# EAGLE schematic mouse_v3 (EAGLE 8.6.1)
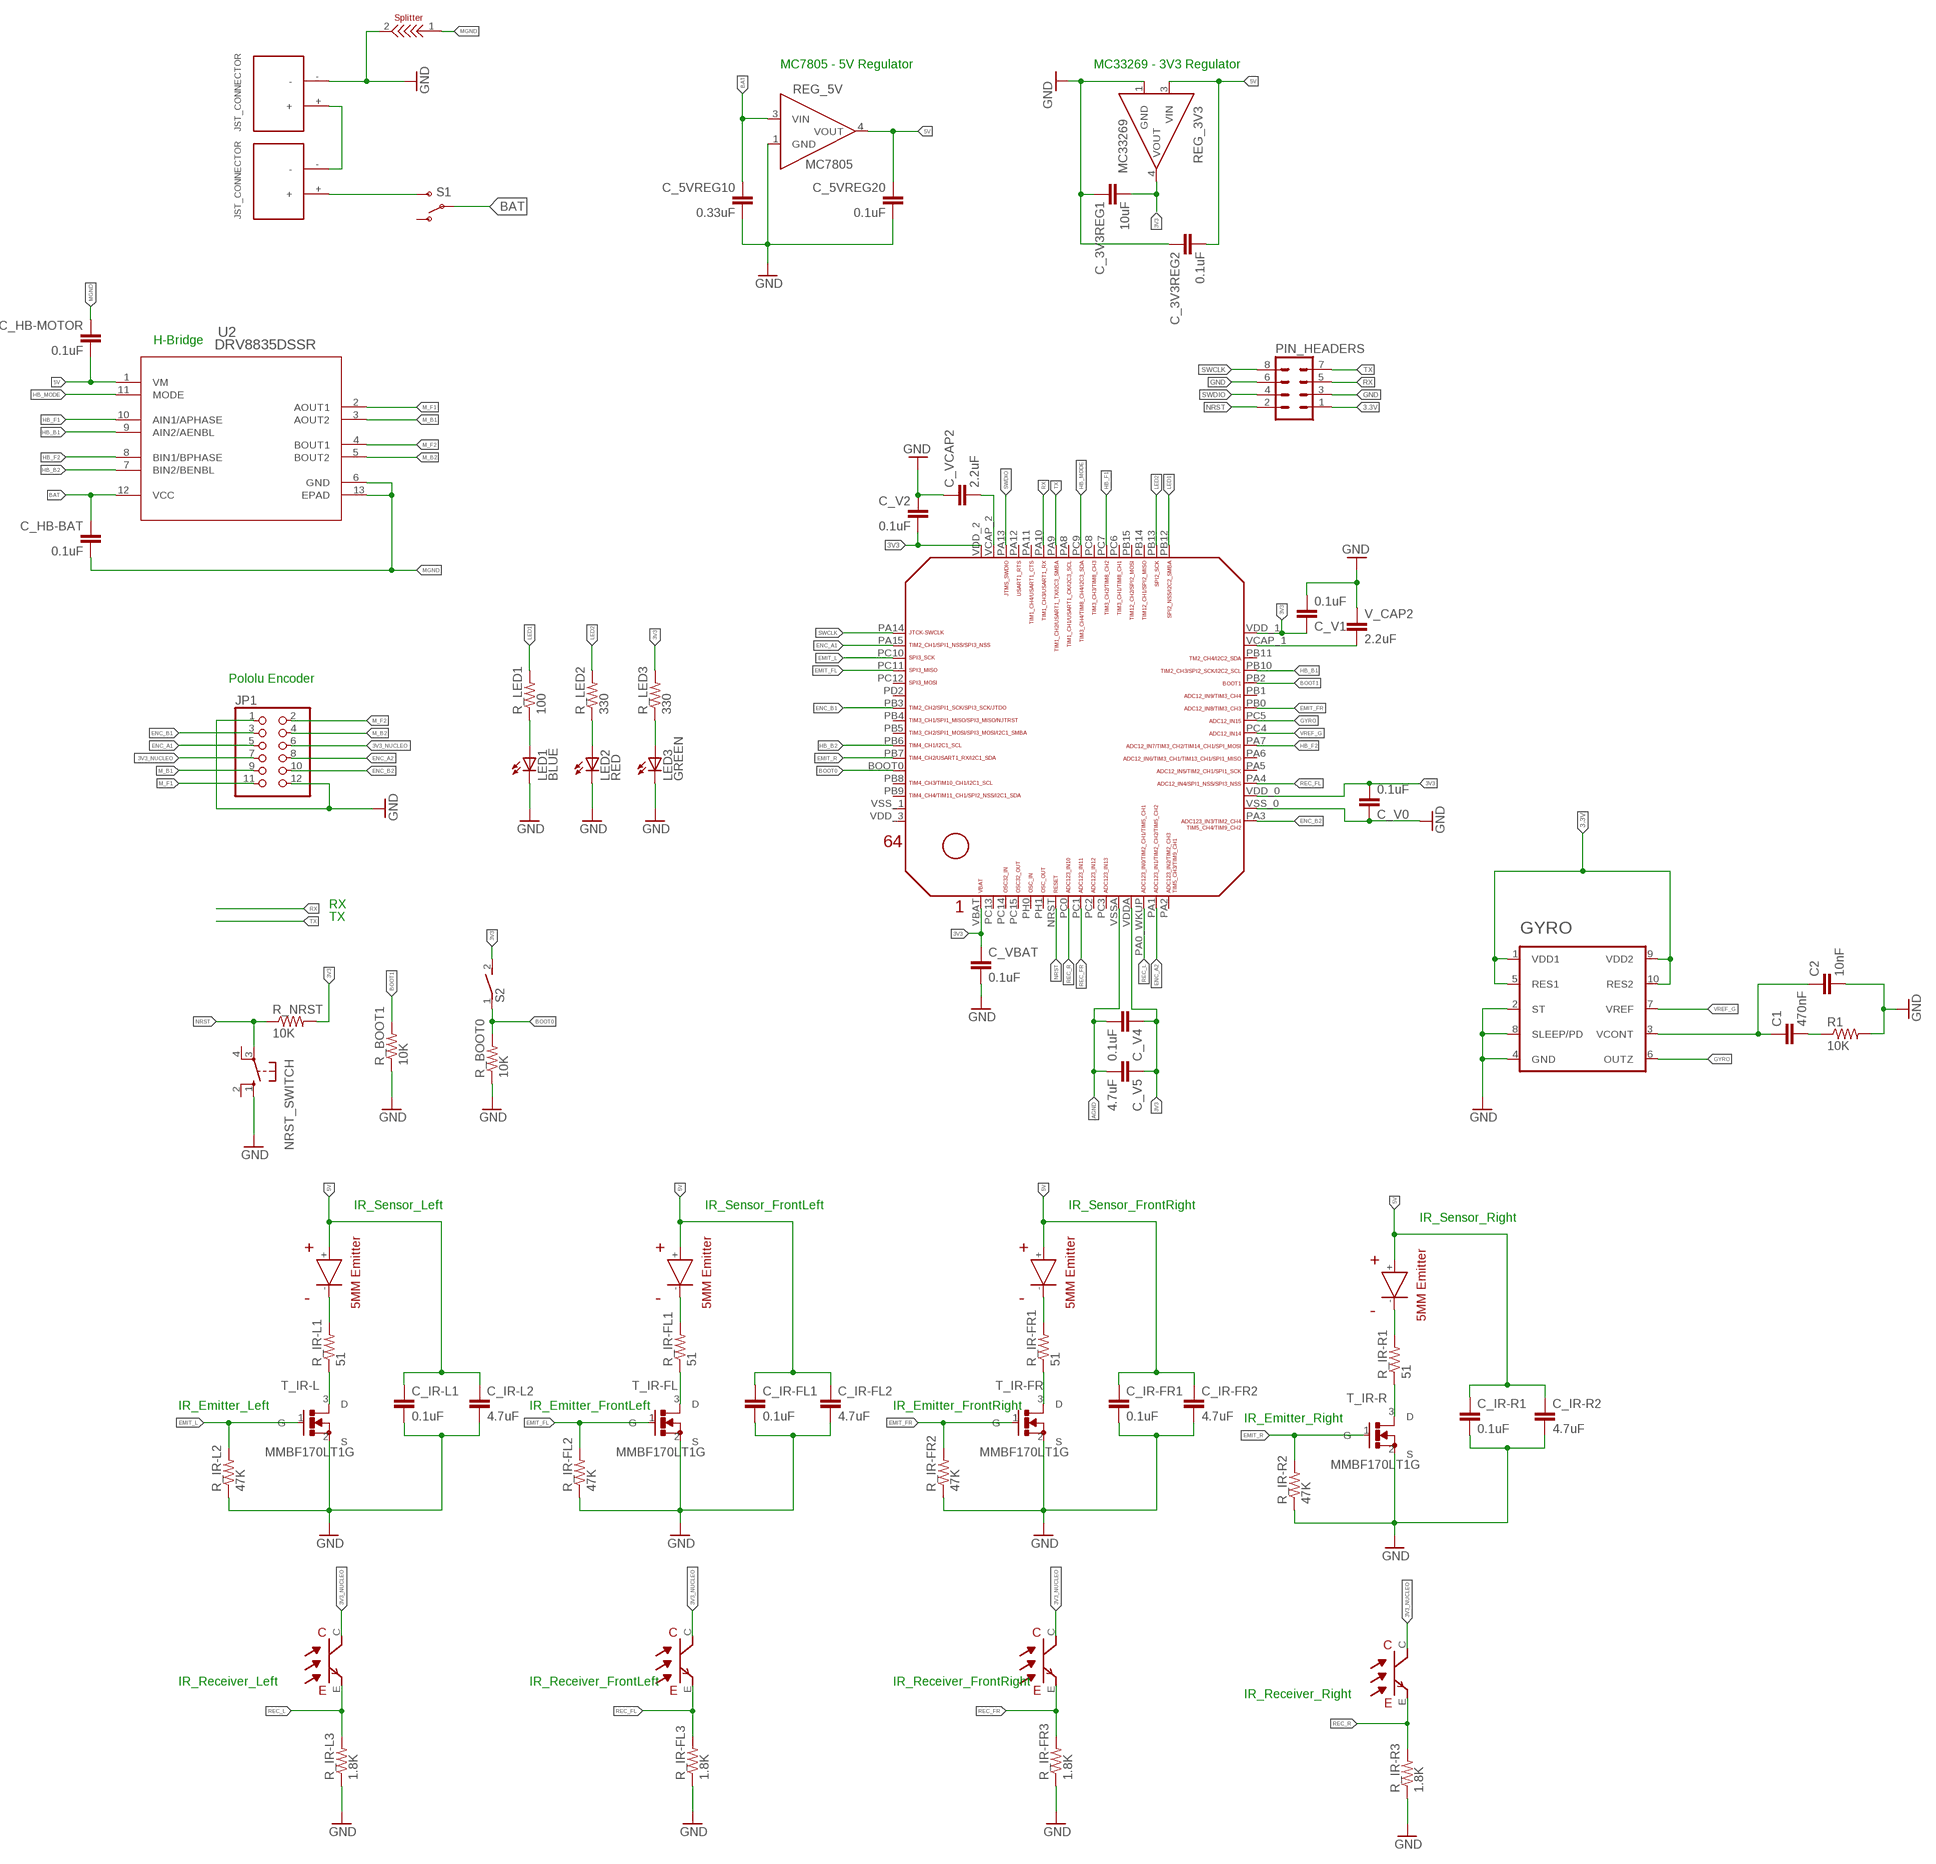
[diagram p0: schematic, sheet 1]

## Parts
C1  470nF  C2,5-3  [C2.5-3]
C2  10nF  C2,5-3  [C2.5-3]
C_3V3REG1  10uF  CAP0603-CAP  [0603-CAP]
C_3V3REG2  0.1uF  CAP0603-CAP  [0603-CAP]
C_5VREG10  0.33uF  CAP0603-CAP  [0603-CAP]
C_5VREG20  0.1uF  CAP0603-CAP  [0603-CAP]
C_HB-BAT  0.1uF  CAP0603-CAP  [0603-CAP]
C_HB-MOTOR  0.1uF  CAP0603-CAP  [0603-CAP]
C_IR-FL1  0.1uF  CAP0603-CAP  [0603-CAP]
C_IR-FL2  4.7uF  CAP0603-CAP  [0603-CAP]
C_IR-FR1  0.1uF  CAP0603-CAP  [0603-CAP]
C_IR-FR2  4.7uF  CAP0603-CAP  [0603-CAP]
C_IR-L1  0.1uF  CAP0603-CAP  [0603-CAP]
C_IR-L2  4.7uF  CAP0603-CAP  [0603-CAP]
C_IR-R1  0.1uF  CAP0603-CAP  [0603-CAP]
C_IR-R2  4.7uF  CAP0603-CAP  [0603-CAP]
C_V0  0.1uF  CAP0603-CAP  [0603-CAP]
C_V1  0.1uF  CAP0603-CAP  [0603-CAP]
C_V2  0.1uF  CAP0603-CAP  [0603-CAP]
C_V4  0.1uF  CAP0603-CAP  [0603-CAP]
C_V5  4.7uF  CAP0603-CAP  [0603-CAP]
C_VBAT  0.1uF  CAP0603-CAP  [0603-CAP]
C_VCAP2  2.2uF  CAP0603-CAP  [0603-CAP]
GYRO  LY3200ALH  [10-TLGA]
IR_FL  EMITTER  [EMITTER]
IR_FR  EMITTER  [EMITTER]
IR_L  EMITTER  [EMITTER]
IR_R  EMITTER  [EMITTER]
JP1  PINHD-2X6  [2X06]
LED1  BLUE  LEDCHIPLED_0603  [CHIPLED_0603]
LED2  RED  LEDCHIPLED_0603  [CHIPLED_0603]
LED3  GREEN  LEDCHIPLED_0603  [CHIPLED_0603]
NRST_SWITCH  10-XX  [B3F-10XX]
PIN_HEADERS  MA04-2  [MA04-2]
R1  10K  R-US_0204/2V  [0204V]
R_BOOT0  10K  R-US_0204/2V  [0204V]
R_BOOT1  10K  R-US_0204/2V  [0204V]
R_IR-FL1  51  1.8KOHM1/10W1%(0603)  [0603-RES]
R_IR-FL2  47K  1.8KOHM1/10W1%(0603)  [0603-RES]
R_IR-FL3  1.8K  1.8KOHM1/10W1%(0603)  [0603-RES]
R_IR-FR1  51  1.8KOHM1/10W1%(0603)  [0603-RES]
R_IR-FR2  47K  1.8KOHM1/10W1%(0603)  [0603-RES]
R_IR-FR3  1.8K  1.8KOHM1/10W1%(0603)  [0603-RES]
R_IR-L1  51  1.8KOHM1/10W1%(0603)  [0603-RES]
R_IR-L2  47K  1.8KOHM1/10W1%(0603)  [0603-RES]
R_IR-L3  1.8K  1.8KOHM1/10W1%(0603)  [0603-RES]
R_IR-R1  51  1.8KOHM1/10W1%(0603)  [0603-RES]
R_IR-R2  47K  1.8KOHM1/10W1%(0603)  [0603-RES]
R_IR-R3  1.8K  1.8KOHM1/10W1%(0603)  [0603-RES]
R_LED1  100  1.8KOHM1/10W1%(0603)  [0603-RES]
R_LED2  330  1.8KOHM1/10W1%(0603)  [0603-RES]
R_LED3  330  1.8KOHM1/10W1%(0603)  [0603-RES]
R_NRST  10K  R-US_0204/2V  [0204V]
REG_3V3  MC33269  [TO-252-3]
REG_5V  MC7805  [TO-252-3]
S1  SWITCH-SPSTKIT  [SWITCH-SPDT_KIT]
S2  DS01E  [DS-01]
T_IR-FL  MMBF170LT1G  [SOT-23]
T_IR-FR  MMBF170LT1G  [SOT-23]
T_IR-L  MMBF170LT1G  [SOT-23]
T_IR-R  MMBF170LT1G  [SOT-23]
U2  DRV8835DSSR  [DSS12_P9X2]
U$1  STM32F405/415_LQFP64  [STM32F405/415_LQFP64]
U$2  JST_CONNECTOR_FEMALE  [JST_CONNECTOR_FEMALE]
U$3  JST_CONNECTOR_FEMALE  [JST_CONNECTOR_FEMALE]
U$4  RECEIVER  [RECEIVER]
U$5  RECEIVER  [RECEIVER]
U$6  RECEIVER  [RECEIVER]
U$7  RECEIVER  [RECEIVER]
U$8  SPLITTER  [SPLITTER]
V_CAP2  2.2uF  CAP0603-CAP  [0603-CAP]

## Nets
3.3V: GYRO.1(VDD1) GYRO.5(RES1) GYRO.9(VDD2) GYRO.10(RES2) PIN_HEADERS.1
3V3: C_3V3REG1.2 C_V0.2 C_V1.1 C_V2.2 C_V4.1 C_V5.1 C_VBAT.1 R_LED3.2 R_NRST.2 REG_3V3.4(VOUT) S2.2 U$1.VBAT U$1.VDD_0 U$1.VDD_1 U$1.VDD_2 U$1.VDDA
3V3_NUCLEO: JP1.6 JP1.7 U$4.C U$5.C U$6.C U$7.C
5V: C_3V3REG2.2 C_5VREG20.1 C_HB-MOTOR.2 C_IR-FL1.1 C_IR-FL2.1 C_IR-FR1.1 C_IR-FR2.1 C_IR-L1.1 C_IR-L2.1 C_IR-R1.1 C_IR-R2.1 IR_FL.+ IR_FR.+ IR_L.+ IR_R.+ REG_3V3.3(VIN) REG_5V.4(VOUT) U2.1(VM)
AGND: C_V4.2 C_V5.2 U$1.VSSA
BAT: C_5VREG10.1 C_HB-BAT.1 REG_5V.3(VIN) S1.2(P) U2.12(VCC)
BOOT0: R_BOOT0.2 S2.1 U$1.BOOT0
BOOT1: R_BOOT1.2 U$1.PB2
EMIT_FL: R_IR-FL2.2 T_IR-FL.1(G) U$1.PC11
EMIT_FR: R_IR-FR2.2 T_IR-FR.1(G) U$1.PB0
EMIT_L: R_IR-L2.2 T_IR-L.1(G) U$1.PC10
EMIT_R: R_IR-R2.2 T_IR-R.1(G) U$1.PB7
ENC_A1: JP1.5 U$1.PA15
ENC_A2: JP1.8 U$1.PA1
ENC_B1: JP1.3 U$1.PB3
ENC_B2: JP1.10 U$1.PA3
GND: C2.2 C_3V3REG1.1 C_3V3REG2.1 C_5VREG10.2 C_5VREG20.2 C_IR-FL1.2 C_IR-FL2.2 C_IR-FR1.2 C_IR-FR2.2 C_IR-L1.2 C_IR-L2.2 C_IR-R1.2 C_IR-R2.2 C_V0.1 C_V1.2 C_V2.1 C_VBAT.2 C_VCAP2.1 GYRO.2(ST) GYRO.4(GND) GYRO.8(SLEEP/PD) JP1.1 JP1.12 LED1.C LED2.C LED3.C NRST_SWITCH.1(S) PIN_HEADERS.3 PIN_HEADERS.6 R1.2 R_BOOT0.1 R_IR-FL2.1 R_IR-FL3.1 R_IR-FR2.1 R_IR-FR3.1 R_IR-L2.1 R_IR-L3.1 R_IR-R2.1 R_IR-R3.1 REG_3V3.1(GND) REG_5V.1(GND) T_IR-FL.2(S) T_IR-FR.2(S) T_IR-L.2(S) T_IR-R.2(S) U$1.VSS_0 U$2.- U$8.2 V_CAP2.1
GYRO: GYRO.6(OUTZ) U$1.PC5
HB_B1: U2.9(AIN2/AENBL) U$1.PB10
HB_B2: U2.7(BIN2/BENBL) U$1.PB6
HB_F1: U2.10(AIN1/APHASE) U$1.PC7
HB_F2: U2.8(BIN1/BPHASE) U$1.PA7
HB_MODE: U2.11(MODE) U$1.PC9
LED1: R_LED1.2 U$1.PB12
LED2: R_LED2.2 U$1.PB13
M_B1: JP1.9 U2.3(AOUT2)
M_B2: JP1.4 U2.5(BOUT2)
M_F1: JP1.11 U2.2(AOUT1)
M_F2: JP1.2 U2.4(BOUT1)
MGND: C_HB-BAT.2 C_HB-MOTOR.1 U2.6(GND) U2.13(EPAD) U$8.1
N$1: R_BOOT1.1 ; supply symbol labelled GND
N$2: C_VCAP2.2 U$1.VCAP_2
N$3: U$2.+ U$3.-
N$4: U$1.VCAP_1 V_CAP2.2
N$5: C1.2 R1.1
N$6: S1.3(S) U$3.+
N$7: IR_FR.- R_IR-FR1.2
N$8: LED1.A R_LED1.1
N$9: C1.1 C2.1 GYRO.3(VCONT)
N$10: LED2.A R_LED2.1
N$11: LED3.A R_LED3.1
N$12: R_IR-FR1.1 T_IR-FR.3(D)
N$15: IR_R.- R_IR-R1.2
N$17: IR_FL.- R_IR-FL1.2
N$22: R_IR-FL1.1 T_IR-FL.3(D)
N$23: R_IR-R1.1 T_IR-R.3(D)
N$24: IR_L.- R_IR-L1.2
N$25: R_IR-L1.1 T_IR-L.3(D)
NRST: NRST_SWITCH.3(P) PIN_HEADERS.2 R_NRST.1 U$1.NRST
REC_FL: R_IR-FL3.2 U$1.PA4 U$5.E
REC_FR: R_IR-FR3.2 U$1.PC1 U$6.E
REC_L: R_IR-L3.2 U$1.PA0_WKUP(PA0_AKUP) U$4.E
REC_R: R_IR-R3.2 U$1.PC0 U$7.E
RX: PIN_HEADERS.5 U$1.PA10
SWCLK: PIN_HEADERS.8 U$1.PA14
SWDIO: PIN_HEADERS.4 U$1.PA13
TX: PIN_HEADERS.7 U$1.PA9
VREF_G: GYRO.7(VREF) U$1.PC4
Unconnected: NRST_SWITCH.2(S1) NRST_SWITCH.4(P1) S1.1(O) U$1.PA2 U$1.PA5 U$1.PA6 U$1.PA8 U$1.PA11 U$1.PA12 U$1.PB1 U$1.PB4 U$1.PB5 U$1.PB8 U$1.PB9 U$1.PB11 U$1.PB14 U$1.PB15 U$1.PC2 U$1.PC3 U$1.PC6 U$1.PC8 U$1.PC12 U$1.PC13 U$1.PC14 U$1.PC15 U$1.PD2 U$1.PH0 U$1.PH1 U$1.VDD_3 U$1.VSS_1

## Notes on the sheet
- MC7805 - 5V Regulator | MC33269 - 3V3 Regulator
- H-Bridge
- Pololu Encoder
- RX
- TX
- IR_Sensor_Left | IR_Sensor_FrontLeft | IR_Sensor_FrontRight
- IR_Sensor_Right
- IR_Emitter_Left | IR_Emitter_FrontLeft | IR_Emitter_FrontRight
- IR_Emitter_Right
- IR_Receiver_Left | IR_Receiver_FrontLeft | IR_Receiver_FrontRight
- IR_Receiver_Right

## Library data of the parts
C1 C2 = capacitor-wima:C: CAPACITOR naming: grid - package width
C_3V3REG1 C_3V3REG2 C_5VREG10 C_5VREG20 C_HB-BAT C_HB-MOTOR C_IR-FL1 C_IR-FL2 C_IR-FR1 C_IR-FR2 C_IR-L1 C_IR-L2 C_IR-R1 C_IR-R2 C_V0 C_V1 C_V2 C_V4 C_V5 C_VBAT C_VCAP2 V_CAP2 = SparkFun:CAP: Capacitor Standard 0603 ceramic capacitor, and 0.1" leaded capacitor.
GYRO = LY3200ALH:LY3200ALH
IR_FL IR_FR IR_L IR_R = sfh4550 _ teft4300:EMITTER
JP1 = pinhead:PINHD-2X6: PIN HEADER
LED1-LED3 = led:LED: LED OSRAM: - CHIPLED LG R971, LG N971, LY N971, LG Q971, LY Q971, LO R971, LY R971 LH N974, LH R974 LS Q976, LO Q976, LY Q976 LO Q996 - Hyper CHIPLED LW Q18S LB Q993, LB Q99A, LB R99A - SideLED LS A670, LO A670, LY A670, LG A670, LP A670 LB A673, LV A673, LT A673, LW A673 LH A674 LY A675 LS A676, LA A676, LO A676, LY A676, LW A676 LS A679, LY A679, LG A679 - Hyper Micro SIDELED® LS Y876, LA Y876, LO Y876, LY Y876 LT Y87S - SmartLED LW L88C, LW L88S LB L89C, LB L89S, LG L890 LS L89K, LO L89K, LY L89K LS L896, LA L896, LO L896, LY L896 - TOPLED LS T670, LO T670, LY T670, LG T670, LP T670 LSG T670, LSP T670, LSY T670, LOP T670, LYG T670 LG T671, LOG T671, LSG T671 LB T673, LV T673, LT T673, LW T673 LH T674 LS T676, LA T676, LO T676, LY T676, LB T676, LH T676, LSB T676, LW T676 LB T67C, LV T67C, LT T67C, LS T67K, LO T67K, LY T67K, LW E67C LS E67B, LA E67B, LO E67B, LY E67B, LB E67C, LV E67C, LT E67C LW T67C LS T679, LY T679, LG T679 LS T770, LO T770, LY T770, LG T770, LP T770 LB T773, LV T773, LT T773, LW T773 LH T774 LS E675, LA E675, LY E675, LS T675 LS T776, LA T776, LO T776, LY T776, LB T776 LHGB T686 LT T68C, LB T68C - Hyper Mini TOPLED® LB M676 - Mini TOPLED Santana® LG M470 LS M47K, LO M47K, LY M47K Source: http://www.osram.convergy.de LUXEON: - LUMILED® LXK2-PW12-R00, LXK2-PW12-S00, LXK2-PW14-U00, LXK2-PW14-V00 LXK2-PM12-R00, LXK2-PM12-S00, LXK2-PM14-U00 LXK2-PE12-Q00, LXK2-PE12-R00, LXK2-PE12-S00, LXK2-PE14-T00, LXK2-PE14-U00 LXK2-PB12-K00, LXK2-PB12-L00, LXK2-PB12-M00, LXK2-PB14-N00, LXK2-PB14-P00, LXK2-PB14-Q00 LXK2-PR12-L00, LXK2-PR12-M00, LXK2-PR14-Q00, LXK2-PR14-R00 LXK2-PD12-Q00, LXK2-PD12-R00, LXK2-PD12-S00 LXK2-PH12-R00, LXK2-PH12-S00 LXK2-PL12-P00, LXK2-PL12-Q00, LXK2-PL12-R00 Source: www.luxeon.com KINGBRIGHT: KA-3528ASYC Source: www.kingbright.com
NRST_SWITCH = switch-omron:10-XX: OMRON SWITCH; MPN: B3F-1000; OC_FARNELL: 176432; OC_NEWARK: 36M3542
PIN_HEADERS = con-lstb:MA04-2: PIN HEADER; OC_FARNELL: unknown; OC_NEWARK: unknown
R1 R_BOOT0 R_BOOT1 R_NRST = rcl:R-US_: RESISTOR, American symbol; SPICEPREFIX: R
R_IR-FL1-R_IR-FL3 R_IR-FR1-R_IR-FR3 R_IR-L1-R_IR-L3 R_IR-R1-R_IR-R3 R_LED1-R_LED3 = SparkFun-Resistors:1.8KOHM1/10W1%(0603): RES-09119; PROD_ID: RES-09119; VALUE: 1.8k
REG_3V3 = MC33269:MC33269
REG_5V = MC33269:MC7805
S1 = SparkFun:SWITCH-SPST: SPST Switch Simple slide switch. Spark Fun Electronics SKU : COM-00102
S2 = switch-dil:DS01E: DIL/CODE SWITCH; OC_FARNELL: unknown; OC_NEWARK: unknown
T_IR-FL T_IR-FR T_IR-L T_IR-R = MMBF170LT1:MMBF170LT1G; MANUFACTURER_PART_NUMBER: MMBF170LT1G; VENDOR: ON Semiconductor
U2 = DRV8835:DRV8835DSSR; MANUFACTURER_PART_NUMBER: DRV8835DSSR; VENDOR: Texas Instruments
U$1 = STM32F10x F4xx:STM32F405/415_LQFP64
U$2 U$3 = JST_CONNECTOR_FEMALE. through hole:JST_CONNECTOR_FEMALE
U$4-U$7 = sfh4550 _ teft4300:RECEIVER
U$8 = splitter:SPLITTER